# EAGLE design cheapboard1.1qfn (EAGLE 6.2)
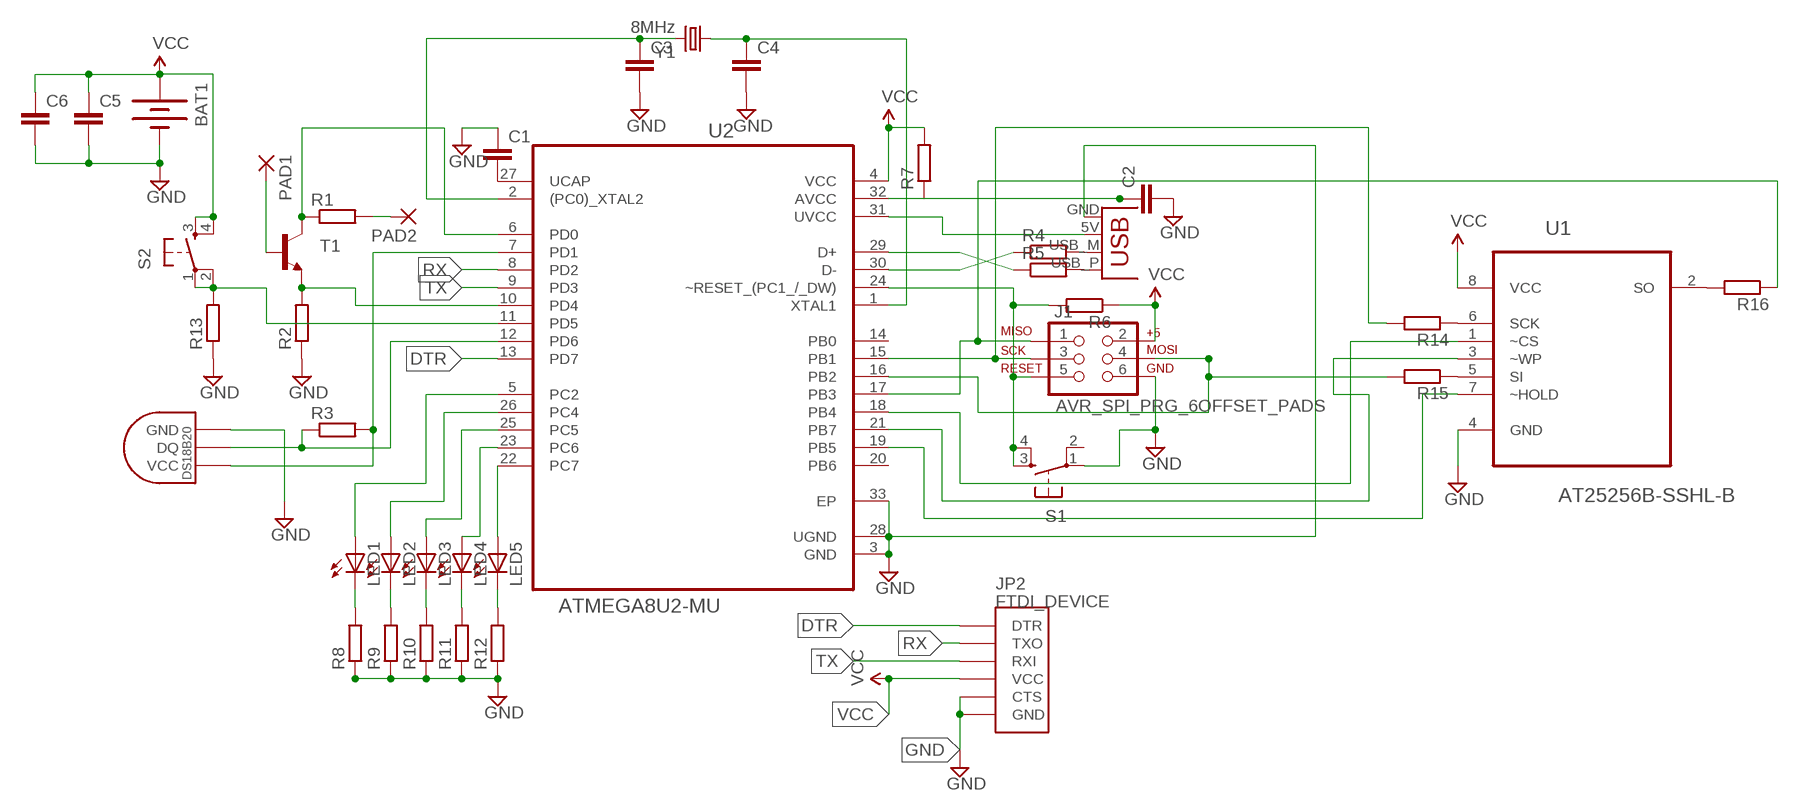
[diagram p0: schematic, sheet 1]

## Parts
BAT1  BATTERY245PTH  [BATTCON_245MM_PTH]
C1  CAP0805  [0805]
C2  CAP0805  [0805]
C3  CAP0805  [0805]
C4  CAP0805  [0805]
C5  CAP0805  [0805]
C6  CAP0805  [0805]
J1  AVR_SPI_PRG_6OFFSET_PADS  [2X3_OFFSET]
JP1  USBPCB  [USB-A-PCB]
JP2  FTDI_DEVICE  [FTDI_DEVICE_SIDE]
LED1  LEDCHIPLED_0805  [CHIPLED_0805]
LED2  LEDCHIPLED_0805  [CHIPLED_0805]
LED3  LEDCHIPLED_0805  [CHIPLED_0805]
LED4  LEDCHIPLED_0805  [CHIPLED_0805]
LED5  LEDCHIPLED_0805  [CHIPLED_0805]
PAD1  SMD5  [SMD2,54-5,08]
PAD2  SMD5  [SMD2,54-5,08]
R1  R-EU_M0805  [M0805]
R2  R-EU_M0805  [M0805]
R3  R-EU_M0805  [M0805]
R4  R-EU_M0805  [M0805]
R5  R-EU_M0805  [M0805]
R6  R-EU_M0805  [M0805]
R7  R-EU_M0805  [M0805]
R8  R-EU_M0805  [M0805]
R9  R-EU_M0805  [M0805]
R10  R-EU_M0805  [M0805]
R11  R-EU_M0805  [M0805]
R12  R-EU_M0805  [M0805]
R13  R-EU_M0805  [M0805]
R14  R-EU_M0805  [M0805]
R15  R-EU_M0805  [M0805]
R16  R-EU_M0805  [M0805]
S1  TAC_SWITCHSMD  [TACTILE_SWITCH_SMD]
S2  TAC_SWITCHSMD  [TACTILE_SWITCH_SMD]
T1  TRANSISTOR_NPNSOT23-3  [SOT23-3]
U1  AT25256B-SSHL-B  [SOIC127P600X175-8N]
U2  ATMEGA8U2-MU  [QFN50P500X500X100-33N]
U$1  DS1820SOIC  [DS18B20_SOIC]
Y1  8MHz  CRYSTAL5X3  [CRYSTAL-SMD-5X3]

## Nets
DTR: JP2.P$1(DTR) U2.13(PD7)
GND: BAT1.2(-) C1.1 C2.2 C3.2 C4.2 C5.2 C6.2 J1.6 JP1.GND JP2.P$5(CTS) JP2.P$6(GND) R2.1 R8.1 R9.1 R10.1 R11.1 R12.1 R13.1 S1.1 U1.4(GND) U2.3(GND) U2.28(UGND) U2.33(EP) U$1.GND
N$1: R1.1 T1.3(C) U2.6(PD0)
N$2: J1.4 R15.2 U2.16(PB2)
N$3: R2.2 T1.2(E) U2.10(PD4)
N$4: J1.5 R6.2 S1.3 S1.4 U2.24(~RESET_(PC1_/_DW))
N$5: J1.3 R14.2 U2.15(PB1)
N$6: R3.1 U2.12(PD6) U$1.DQ
N$7: J1.1 R16.1 U2.17(PB3)
N$8: JP1.5V(VBUS) U2.31(UVCC)
N$9: C2.1 R7.1 U2.32(AVCC)
N$10: R4.1 U2.30(D-)
N$11: R5.1 U2.29(D+)
N$12: JP1.USB_M(D-) R4.2
N$13: JP1.USB_P(D+) R5.2
N$14: R3.2 U2.7(PD1) U$1.VCC
N$15: R14.1 U1.6(SCK)
N$16: C1.2 U2.27(UCAP)
N$17: C4.1 U2.1(XTAL1) Y1.1
N$18: C3.1 U2.2((PC0)_XTAL2) Y1.3
N$19: LED1.A U2.5(PC2)
N$20: LED2.A U2.26(PC4)
N$21: LED3.A U2.25(PC5)
N$22: LED4.A U2.23(PC6)
N$23: LED5.A U2.22(PC7)
N$24: LED1.C R8.2
N$25: LED2.C R9.2
N$26: LED3.C R10.2
N$27: LED4.C R11.2
N$28: LED5.C R12.2
N$29: R15.1 U1.5(SI)
N$30: R13.2 S2.1 S2.2 U2.11(PD5)
N$31: R16.2 U1.2(SO)
N$34: U1.1(~CS) U2.18(PB4)
N$35: U1.3(~WP) U2.21(PB7)
N$36: U1.7(~HOLD) U2.19(PB5)
PAD1: PAD1.1(P) T1.1(B)
PAD2: PAD2.1(P) R1.2
RX: JP2.P$2(TXO) U2.8(PD2)
TX: JP2.P$3(RXI) U2.9(PD3)
VCC: BAT1.3(+) C5.1 C6.1 J1.2 JP2.P$4(VCC) R6.1 R7.2 S2.3 S2.4 U1.8(VCC) U2.4(VCC)
Unconnected: S1.2 U2.14(PB0) U2.20(PB6)

## Library data of the parts
BAT1 = SparkFun-Electromechanical:BATTERY: Battery Holders Various common sizes : AA, AAA, 20mm coin cell and 12mm coin cell. 20MM_4LEGS, BATT-10373
C1-C6 = SparkFun-Passives:CAP: Capacitor Standard 0603 ceramic capacitor, and 0.1" leaded capacitor.
J1 = SparkFun-Connectors:AVR_SPI_PRG_6: AVR ISP 6 Pin This is the reduced ISP connector for AVR programming. Common on Arduino. This footprint will take up less PCB space and can be used with a 10-pin to 6-pin adapter such as SKU: BOB-08508
JP1 = SparkFun-Connectors:USB: USB Connectors USB-B-PTH is fully proven SKU : PRT-00139/CONN-08278 USB-miniB is fully proven SKU : PRT-00587 USB-A-PCB is untested. USB-A-H is throughly reviewed, but untested. Spark Fun Electronics SKU : PRT-00437 USB-B-SMT is throughly reviewed, but untested. Needs silkscreen touching up. USB-A-S has not been used/tested USB-MB-H has not been used/tested USB-MICROB has been used. CONN-09505
JP2 = SparkFun-Connectors:FTDI_DEVICE: Connector which mates to FTDI basic or FTDI cable.
LED1-LED5 = led:LED: LED OSRAM: - CHIPLED LG R971, LG N971, LY N971, LG Q971, LY Q971, LO R971, LY R971 LH N974, LH R974 LS Q976, LO Q976, LY Q976 LO Q996 - Hyper CHIPLED LW Q18S LB Q993, LB Q99A, LB R99A - SideLED LS A670, LO A670, LY A670, LG A670, LP A670 LB A673, LV A673, LT A673, LW A673 LH A674 LY A675 LS A676, LA A676, LO A676, LY A676, LW A676 LS A679, LY A679, LG A679 - Hyper Micro SIDELED® LS Y876, LA Y876, LO Y876, LY Y876 LT Y87S - SmartLED LW L88C, LW L88S LB L89C, LB L89S, LG L890 LS L89K, LO L89K, LY L89K LS L896, LA L896, LO L896, LY L896 - TOPLED LS T670, LO T670, LY T670, LG T670, LP T670 LSG T670, LSP T670, LSY T670, LOP T670, LYG T670 LG T671, LOG T671, LSG T671 LB T673, LV T673, LT T673, LW T673 LH T674 LS T676, LA T676, LO T676, LY T676, LB T676, LH T676, LSB T676, LW T676 LB T67C, LV T67C, LT T67C, LS T67K, LO T67K, LY T67K, LW E67C LS E67B, LA E67B, LO E67B, LY E67B, LB E67C, LV E67C, LT E67C LW T67C LS T679, LY T679, LG T679 LS T770, LO T770, LY T770, LG T770, LP T770 LB T773, LV T773, LT T773, LW T773 LH T774 LS E675, LA E675, LY E675, LS T675 LS T776, LA T776, LO T776, LY T776, LB T776 LHGB T686 LT T68C, LB T68C - Hyper Mini TOPLED® LB M676 - Mini TOPLED Santana® LG M470 LS M47K, LO M47K, LY M47K Source: http://www.osram.convergy.de LUXEON: - LUMILED® LXK2-PW12-R00, LXK2-PW12-S00, LXK2-PW14-U00, LXK2-PW14-V00 LXK2-PM12-R00, LXK2-PM12-S00, LXK2-PM14-U00 LXK2-PE12-Q00, LXK2-PE12-R00, LXK2-PE12-S00, LXK2-PE14-T00, LXK2-PE14-U00 LXK2-PB12-K00, LXK2-PB12-L00, LXK2-PB12-M00, LXK2-PB14-N00, LXK2-PB14-P00, LXK2-PB14-Q00 LXK2-PR12-L00, LXK2-PR12-M00, LXK2-PR14-Q00, LXK2-PR14-R00 LXK2-PD12-Q00, LXK2-PD12-R00, LXK2-PD12-S00 LXK2-PH12-R00, LXK2-PH12-S00 LXK2-PL12-P00, LXK2-PL12-Q00, LXK2-PL12-R00 Source: www.luxeon.com KINGBRIGHT: KA-3528ASYC Source: www.kingbright.com
PAD1 PAD2 = wirepad:SMD5: SMD PAD
R1-R16 = rcl:R-EU_: RESISTOR, European symbol
S1 S2 = SparkFun-Electromechanical:TAC_SWITCH: Momentary Switch Button commonly used for reset or general input. Spark Fun Electronics SKU : COM-00097 SMT- SWCH-08247; PROD_ID: SWCH-08247
T1 = SparkFun-DiscreteSemi:TRANSISTOR_NPN: Generic NPN BJT. MMBT2222 is the common NPN we use. Double check against datasheet- not all devices are the same!
U1 = Mine:AT25256B-SSHL-B: SPI Serial EEPROM; MPN: AT25256B-SSHL-B; OC_FARNELL: 1841577; OC_NEWARK: 12T1358; PACKAGE: SOIC-8; SUPPLIER: Atmel
U2 = Atmel_By_element14_Batch_1:ATMEGA8U2-MU: Microcontroller with 8/16/32K Bytes of ISP Flash and USB Controller; MPN: ATMEGA8U2-MU; OC_FARNELL: 1748536; OC_NEWARK: 26R5642; PACKAGE: QFN-32; SUPPLIER: Atmel
U$1 = Ava:DS1820: DS18B20 Programmable Resolution 1-Wire Digital Thermometer Description The DS18B20 digital thermometer provides 9-bit to 12-bit Celsius temperature measurements and has an alarm function with nonvolatile user-programmable upper and lower trigger points. The DS18B20 communicates over a 1-Wire® bus that by definition requires only one data line (and ground) for communication with a central microprocessor. It has an operating temperature range of -55°C to +125°C and is accurate to ±0.5°C over the range of -10°C to +85°C. In addition, the DS18B20 can derive power directly from the data line ("parasite power"), eliminating the need for an external power supply. Each DS18B20 has a unique 64-bit serial code, which allows multiple DS18B20s to function on the same 1-Wire bus. Thus, it is simple to use one microprocessor to control many DS18B20s distributed over a large area. Applications that can benefit from this feature include HVAC environmental controls, temperature monitoring systems inside buildings, equipment, or machinery, and process monitoring and control systems.
Y1 = SparkFun-FreqCtrl:CRYSTAL: Various standard crystals. Proven footprints. Spark Fun Electronics SKU : COM-00534

## Board
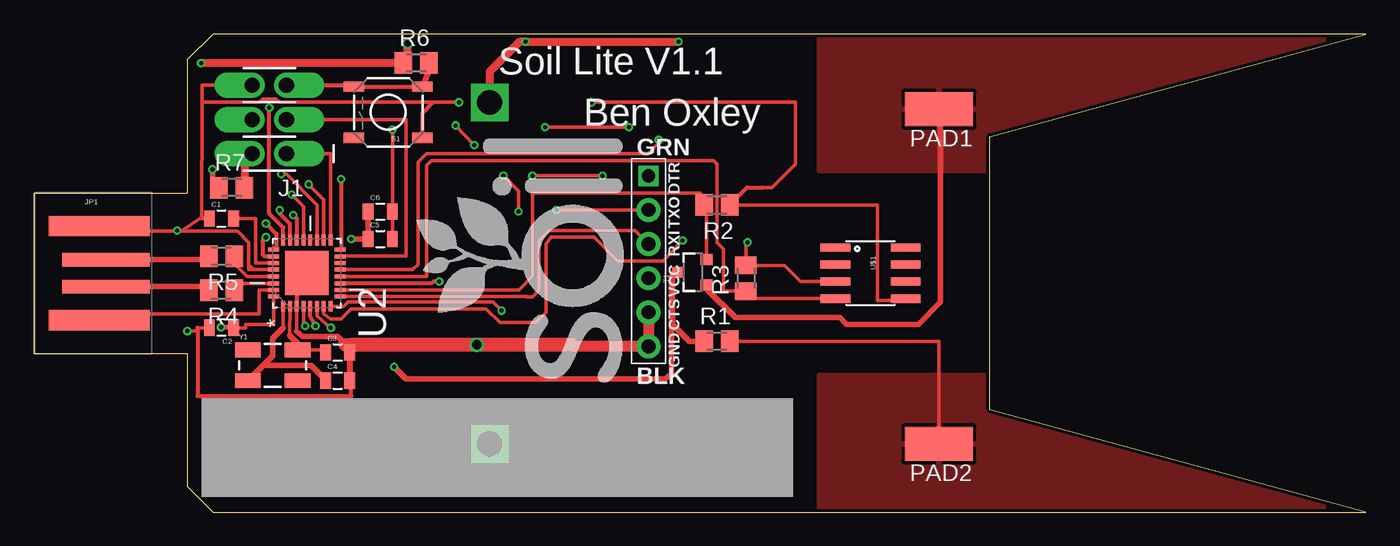
[diagram p1: board, top side]
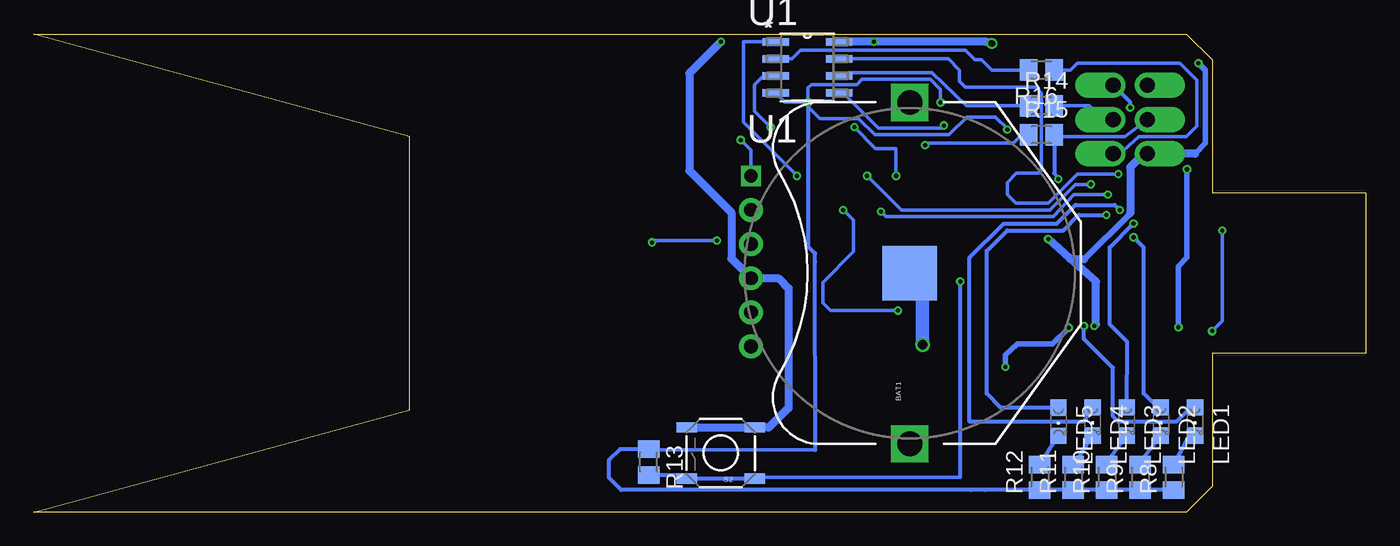
[diagram p2: board, bottom side, seen from below]

Size 99.06 x 35.56 mm. Coordinates in mm from the lower left corner, seen from the top.
Outline: 11.43,1.91 13.34,0 99.06,0 71.12,7.62 71.12,27.94 99.06,35.56 13.34,35.56 11.43,33.66 11.43,23.75 0,23.75 0,11.81 11.43,11.81 11.43,1.91
Copper layers (1*16): Top 0.035mm / dielectric 1.5mm / Bottom 0.035mm
Design rules: minimum track width 6mil, minimum drill 12mil, track to track 6mil, track to pad 6mil, pad to pad 6mil, via to via 6mil, smd to smd 0mil, copper to edge 10mil, drill to drill 10mil, minimum pad ring 10mil, minimum via ring 6mil, stop-mask expansion 2mil, vias tented up to drill 100mil, thermal gap 10mil

### Footprints (pad centres in the part's own frame; a part is rotated, then mirrored left to right if it is on the bottom)
BATTCON_245MM_PTH = drill 1.854 square: 1 -12.7,0; 3 12.7,0 | smd 4.064 x 4.064: 2 0,0
0805 = smd 0.8 x 1.2: 1 -0.9,0; 2 0.9,0
2X3_OFFSET = drill 1.118 pad 1.88 offset: 1 -2.54,-1.27; 2 -2.54,1.27; 3 0,-1.27; 4 0,1.27; 5 2.54,-1.27; 6 2.54,1.27
USB-A-PCB = smd 7.5 x 1.5: 5V -0.2,-3.5; GND -0.2,3.5 | smd 6.5 x 1: USB_M 0.3,-1; USB_P 0.3,1
FTDI_DEVICE_SIDE = drill 1 square: P$1 -6.35,0 | drill 1.016 pad 1.778: P$2 -3.81,0; P$3 -1.27,0; P$4 1.27,0; P$5 3.81,0; P$6 6.35,0
CHIPLED_0805 = smd 1.2 x 1.2: A 0,-1.05; C 0,1.05
SMD2,54-5,08 = smd 2.54 x 5.08: 1 0,0
M0805 = smd 1.3 x 1.6: 1 -0.95,0; 2 0.95,0
TACTILE_SWITCH_SMD = smd 1.524 x 0.762: 1 -2.54,1.905; 2 2.54,1.905; 3 -2.54,-1.905; 4 2.54,-1.905
SOT23-3 = smd 0.8 x 0.9: 1 -0.95,-1; 2 0.95,-1; 3 0,1.1
SOIC127P600X175-8N = smd 1.981 x 0.559: 1 -2.362,1.905; 2 -2.362,0.635; 3 -2.362,-0.635; 4 -2.362,-1.905; 5 2.362,-1.905; 6 2.362,-0.635; 7 2.362,0.635; 8 2.362,1.905
QFN50P500X500X100-33N = smd 0.813 x 0.305: 1 -2.464,1.753; 2 -2.464,1.245; 3 -2.464,0.762; 4 -2.464,0.254; 5 -2.464,-0.254; 6 -2.464,-0.762; 7 -2.464,-1.245; 8 -2.464,-1.753; 17 2.464,-1.753; 18 2.464,-1.245; 19 2.464,-0.762; 20 2.464,-0.254; 21 2.464,0.254; 22 2.464,0.762; 23 2.464,1.245; 24 2.464,1.753 | smd 0.305 x 0.813: 9 -1.753,-2.464; 10 -1.245,-2.464; 11 -0.762,-2.464; 12 -0.254,-2.464; 13 0.254,-2.464; 14 0.762,-2.464; 15 1.245,-2.464; 16 1.753,-2.464; 25 1.753,2.464; 26 1.245,2.464; 27 0.762,2.464; 28 0.254,2.464; 29 -0.254,2.464; 30 -0.762,2.464; 31 -1.245,2.464; 32 -1.753,2.464 | smd 3.251 x 3.251: 33 0,0
DS18B20_SOIC = smd 0.61 x 2.21: DQ 1.905,-2.616; GND 1.905,2.616; NC -1.905,-2.616; NC2 -0.635,-2.616; NC3 -1.905,2.616; NC4 -0.635,2.616; NC5 0.635,2.616; VCC 0.635,-2.616
CRYSTAL-SMD-5X3 = smd 1.9 x 1.1: 1 -1.85,-1.15; 2 1.85,-1.15; 3 1.85,1.15; 4 -1.85,1.15

### Placement (x,y rotation side)
BAT1  33.91,17.78 90 bottom
C1  13.97,21.84 0 top
C2  13.97,13.72 180 top
C3  22.61,11.87 0 top
C4  22.61,9.78 0 top
C5  25.78,20.32 0 top
C6  25.78,22.35 0 top
J1  17.53,29.21 90 top
JP1  5.08,17.78 0 top
JP2  45.72,18.67 270 top
LED1  12.7,6.74 180 bottom
LED2  15.24,6.74 180 bottom
LED3  17.78,6.74 180 bottom
LED4  20.32,6.74 180 bottom
LED5  22.86,6.72 180 bottom
PAD1  67.31,29.97 90 top
PAD2  67.31,5.08 90 top
R1  50.8,12.7 0 top
R2  50.8,22.86 180 top
R3  52.96,17.4 90 top
R4  13.97,16.51 180 top
R5  13.97,19.05 180 top
R6  28.45,33.4 0 top
R7  14.73,24.13 0 top
R8  14.29,2.6 90 bottom
R9  16.78,2.6 90 bottom
R10  19.27,2.6 90 bottom
R11  21.76,2.6 90 bottom
R12  24.24,2.6 90 bottom
R13  53.33,3.72 270 bottom
R14  24.13,30.23 0 bottom
R15  24.13,28.07 0 bottom
R16  24.13,32.89 180 bottom
S1  26.37,29.74 180 top
S2  47.97,4.39 180 bottom
T1  49.02,17.84 90 top
U1  41.53,33.08 0 bottom
U2  20.32,17.78 90 top
U$1  62.23,17.78 270 top
Y1  17.78,10.92 0 top

### Tracks (layer width: path | path; a pad name or v marks a point on that pad's centre or on a via)
DTR  (via drill 0.3)
  Top 0.254: U2.13 28.19,18.03 28.57,18.41 28.57,26.04 29.21,26.67 45.72,26.67 46.48,27.43 v46.48,27.69
  Bottom 0.254: v46.48,27.69 45.72,26.92 JP2.P$1
GND  (via drill 0.3, 0.3 pad 0.25, 0.7)
  Top 0.254: J1.6 12.52,31.75 12.52,30.48 | 12.51,21.86 C1.1 | U2.3 19.56,13.45 | 22.61,13.06 22.64,13.03 | 23.19,12.45 C3.2 | R2.1 62.74,22.86 62.74,15.75 64.85,15.75 U$1.GND | C2.2 12.32,13.72 | 12.32,13.72 12.19,13.72 | 23.62,8.64 23.63,8.64 C4.2 | 12.51,21.86 12.52,30.48 | 12.52,30.48 16.76,30.48 17.02,30.73 18.03,30.73 18.29,30.48 29.72,30.48 v31.62,30.48 | v41.47,30.48 56.64,30.48 56.64,25.89 54.9,24.16 54.22,24.16 | 16,18.29 16,18.03 U2.28 16.38,18.03 16.13,18.29 16,18.29 | 10.99,20.89 8.5,20.89 8.18,21.34 JP1.GND | C5.2 C6.2 26.68,28.44 v26.67,28.45 | 16,18.29 16,20.07 15.18,20.89 10.99,20.89 | 10.99,20.89 11.05,20.95 | 11.05,20.95 v10.67,20.95 | v11.43,13.46 12.06,13.46 12.32,13.72 | 12.51,21.86 12.33,21.86 11.05,20.95
  Top 0.305: R2.1 53.05,24.16 54.22,24.16 | 29.72,30.48 28.91,29.67 S1.1 | C1.1 12.57,21.84 | 12.19,13.72 12.19,8.64 23.62,8.64 23.62,12.57 | 20.32,16.83 19.56,16.07 U2.3
  Top 0.406: 19.56,13.45 20.02,13.06 22.61,13.06 | 22.64,13.03 22.86,12.83 22.86,12.45 23.19,12.45 | C4.2 C3.2 | U2.33 20.32,16.83
  Top 0.813: 23.62,12.57 40.01,12.57 v32.96,12.45 | JP2.P$5 JP2.P$6 40.13,12.32 39.5,12.45
  Top 1.016: 23.19,12.45 v32.96,12.45 39.5,12.45
  Bottom 0.254: v26.67,28.45 26.67,28.51 27.56,29.4 29.65,29.4 30.99,28.07 36.51,28.07 37.72,29.27 40.58,29.27 41.47,30.16 v41.47,30.48 | v10.67,20.95 10.67,14.22 v11.43,13.46 | v41.47,30.48 43.18,30.48 U1.4 | v31.62,30.48 31.62,31.43 32.38,32.19 37.47,32.19 37.85,31.81 41.21,31.81 41.47,31.56 v41.47,30.48
  Bottom 0.305: R8.1 R9.1 R10.1 R11.1 | R11.1 R12.1 | R11.1 28.32,1.65 29.34,1.65 55.37,1.65 56.26,2.54 56.26,3.87 55.44,4.7 53.29,4.7 R13.1 40.95,4.62 40.96,18.61 40.96,19.24 41.47,19.75 v41.47,30.48
  Bottom 1.016: v32.96,12.45 32.96,16.95 BAT1.2
N$1  (via drill 0.3)
  Top 0.254: U2.6 21.08,14.61 v22.1,13.72
  Top 0.406: R1.1 48.77,12.7 47.5,13.97 47.5,17.7 T1.3 47.75,17.84 47.43,17.53 47.41,10.33 46.99,9.91 27.69,9.91 v26.8,10.79
  Bottom 0.406: v26.8,10.79 26.8,11.68 25.91,12.51 23.3,12.51 v22.1,13.72
N$2  (via drill 0.3)
  Top 0.305: v22.86,24.77 22.86,19.61 U2.16
  Bottom 0.254: R15.2 23.24,28.07 23.05,27.94 17.91,27.94 J1.4
  Bottom 0.305: R15.2 23.18,25.21 v22.86,24.77
N$3
  Top 0.254: U2.10 36.07,16.51 36.09,16.54 37.08,17.55 37.08,23.75 49.28,23.75 | 49.28,23.75 49.53,23.75 49.85,23.37 50.02,23.19 T1.2 | R2.2 49.85,23.18 49.28,23.75
N$4  (via drill 0.3)
  Top 0.305: J1.5 23.72,31.75 S1.4 S1.3 | U2.24 18.57,21.18 17.53,22.23 v17.53,30.1
  Top 0.406: R6.2 29.46,33.15 29.34,32.7 28.93,31.62 S1.3
  Bottom 0.305: v17.53,30.1 17.53,30.48 J1.5
N$5
  Top 0.254: J1.3 27.69,29.21 27.69,19.05 22.78,19.05 U2.15
  Bottom 0.254: R14.2 20.57,30.23 19.68,29.34 18.92,29.34 J1.3
N$6
  Top 0.254: U$1.DQ 53.09,15.88 R3.1 51.31,16.45 51.31,19.56 50.8,20.07 50.8,25.91 50.55,26.16 29.59,26.16 29.21,25.78 29.21,17.53 U2.12
N$7
  Top 0.254: J1.1 22.07,26.67 U2.17
  Bottom 0.254: R16.1 21.97,32.89 21.46,33.4 13.84,33.4 12.57,32.13 12.57,28.7 13.34,27.94 16.89,27.94 18.41,26.54 18.67,26.54 J1.1
N$8
  Top 0.254: U2.31 16.76,16.54 16.76,14.73 4.88,14.73 JP1.5V
N$9  (via drill 0.3)
  Top 0.254: C2.1 15.75,13.72 15.75,13.97 17.86,13.97 U2.32 | R7.1 13.72,24.13 13.72,24.38
  Top 0.406: R7.1 13.3,24.13 v13.3,25.5 | v13.93,13.75 14.93,13.77 C2.1
  Bottom 0.406: v13.3,25.5 13.3,18.92 13.93,18.29 v13.93,13.75
N$10
  Top 0.254: U2.30 15.43,17.02 R4.1
N$11
  Top 0.254: U2.29 15.88,17.53 14.86,18.54 14.86,18.99 R5.1
N$12
  Top 0.406: JP1.USB_M 13.02,16.78 R4.2
N$13
  Top 0.406: JP1.USB_P 13.02,18.78 R5.2
N$14  (via drill 0.3)
  Top 0.254: U2.7 21.57,14.76 22.1,14.35 22.86,14.35 23.62,15.11 33.66,15.11 34.67,14.1 37.34,14.1 38.1,14.86 38.1,19.94 38.48,20.45 41.66,20.45 43.43,18.67 46.8,18.67 v48.26,20.19 | v53.09,20.07 52.96,20 R3.2 55.82,18.35 57.02,17.14 U$1.VCC
  Bottom 0.254: v48.26,20.19 52.83,20.19 v53.09,20.07
N$15
  Bottom 0.254: R14.1 29.72,30.23 32.26,32.7 38.48,32.7 | 38.35,32.51 38.48,32.7 | 38.48,32.7 U1.6
N$16
  Top 0.254: U2.27 16.51,18.54 16.51,21.84 C1.2
N$17
  Top 0.254: 18.57,13.71 U2.1
  Top 0.406: 18.57,13.71 17.78,12.92 17.78,11.62 Y1.1 17.08,10.92 20.64,10.92 21.72,9.84 C4.1
N$18
  Top 0.254: 20.09,12.1 20.47,12.07 Y1.3 20.9,12.06 21.72,12.06 21.84,11.87 C3.1 | 19.05,13.14 U2.2
  Top 0.406: 20.09,12.1 19.05,13.14
N$19  (via drill 0.3)
  Top 0.305: v20.95,13.84 20.83,14.1 20.57,14.55 U2.5
  Bottom 0.305: LED1.A 13.21,7.87 12.95,7.87 14.1,6.73 18.41,6.73 18.8,7.11 18.8,10.73 20.95,12.89 v20.95,13.84
N$20  (via drill 0.3)
  Top 0.305: v17.27,20.45 17.02,20.19 17.02,19.18 17.14,19.05 17.83,19.05 U2.26
  Bottom 0.305: LED2.A 15.48,7.79 16.51,8.83 16.51,19.68 v17.27,20.45
N$21  (via drill 0.3)
  Top 0.305: v17.27,21.46 18.03,20.7 18.03,19.71 U2.25
  Bottom 0.305: LED3.A 17.74,12.68 19.05,13.97 19.05,19.68 v17.27,21.46
N$22  (via drill 0.3)
  Top 0.305: v18.29,22.48 18.29,22.23 19.05,21.46 19.05,20.27 U2.23
  Bottom 0.305: LED4.A 20.95,6.73 29.46,6.73 29.46,18.92 26.92,21.46 22.99,21.46 21.59,22.86 18.67,22.86 v18.29,22.48
N$23  (via drill 0.3)
  Top 0.305: v19.3,22.1 19.56,21.84 U2.22
  Bottom 0.305: LED5.A 27.14,7.77 28.19,8.83 28.19,19.43 26.67,20.95 22.5,20.95 21.34,22.12 21.21,22.1 v19.3,22.1
N$24
  Bottom 0.305: R8.2 13.14,5.68 LED1.C
N$25
  Bottom 0.305: LED2.C 16.87,3.64 R9.2
N$26
  Bottom 0.305: LED3.C 19.33,3.68 R10.2
N$27
  Bottom 0.305: R11.2 21.69,3.56 LED4.C
N$28
  Bottom 0.305: R12.2 22.91,5.68 LED5.C
N$29  (via drill 0.3)
  Top 0.254: v32.77,27.3 v31.37,28.77
  Bottom 0.254: R15.1 25.59,28.07 26.23,27.43 32.7,27.43 v32.77,27.3 | v31.37,28.77 v31.37,28.78 31.38,28.78 31.56,28.57 36.26,28.57 38.86,31.18 U1.5
N$30  (via drill 0.3 pad 0.25)
  Top 0.305: v30.16,17.14 29.72,17.14 29.59,17.02 U2.11
  Bottom 0.305: R13.2 50.85,2.77 S2.2 S2.1 45.54,2.62 30.16,2.6 v30.16,17.14 30.06,17.12
N$31
  Bottom 0.254: R16.2 27.81,32.89 28.57,33.66 29.08,33.66 29.78,34.35 42.04,34.35 42.67,33.72 U1.2
N$34  (via drill 0.3)
  Top 0.254: U2.18 21.57,23.27 v20.45,24.38 | v37.08,25.02 v42.29,25.02
  Bottom 0.254: v20.45,24.38 21.59,24.38 23.5,22.48 34.54,22.48 v37.08,25.02 | v42.29,25.02 46.29,29.02 46.29,34.99 U1.1
N$35  (via drill 0.3)
  Top 0.254: U2.21 20.07,22.73 v19.18,23.62 | v36.07,22.35 36.07,23.88 v34.92,25.02 | v44.26,28.64 v38.04,28.64
  Bottom 0.254: v19.18,23.62 21.72,23.62 23.24,21.97 35.69,21.97 v36.07,22.35 | v34.92,25.02 34.92,27.05 36.45,27.05 v38.04,28.64 | U1.3 44.83,32.45 45.47,31.81 45.47,29.84 v44.26,28.64
N$36  (via drill 0.3)
  Top 0.254: U2.19 21.08,22.86 18.8,25.15 v18.41,25.15
  Bottom 0.254: v18.41,25.15 21.46,25.15 23.62,22.99 26.04,22.99 26.67,23.62 26.67,24.51 25.97,25.21 24.32,25.21 24.13,25.4 24.13,31.18 24.51,31.62 29.78,31.62 30.23,32.07 30.23,32.89 31.05,33.72 U1.7
PAD1
  Top 0.406: T1.1 50.1,17.02 50.1,16.51 52.2,14.48 59.94,14.48 60.45,13.97 65.79,13.97 67.44,15.62 67.44,28.32 67.31,30.99 PAD1.1
  pour Top: 108.2,36.7 58.42,39.24 58.42,25.4 90.68,25.4
PAD2
  Top 0.254: R1.2 67.31,12.7 PAD2.1
  pour Top (isolate 0.254): 89.28,10.16 58.42,10.16 58.42,-0.51 108.97,-0.51
RX  (via drill 0.3)
  Top 0.254: U2.8 23.06,15.32 23.37,15.62 34.16,15.62 v34.8,14.99 | v38.86,22.48 JP2.P$2
  Bottom 0.254: v34.8,14.99 39.81,14.99 40.39,15.56 40.39,17.08 38.1,19.37 38.1,21.72 v38.86,22.48
TX
  Top 0.254: U2.9 36.68,16.03 36.7,16 37.08,16 37.59,16.51 37.59,20.19 38.35,20.95 44.7,20.95 JP2.P$3
VCC  (via drill 0.3, 0.5)
  Top 0.254: U2.4 20.07,13.97 v20.19,13.84
  Top 0.305: R6.1 27.81,33.15
  Top 0.406: C6.1 C5.1 v23.62,20.32
  Top 0.61: J1.2 15.68,26.67 R7.2 | R6.1 v12.45,33.4 | 27.81,33.15 v27.81,34.86 | v47.94,34.99 v36.58,34.99 36.13,34.99 33.91,32.77 BAT1.3
  Bottom 0.254: U1.8 v36.58,34.99 | 45.41,6.29 S2.3
  Bottom 0.406: v12.45,33.4 11.94,32.89 11.94,27.43 12.7,26.67 | 17.53,22.23 20.95,18.8
  Bottom 0.61: v47.94,34.99 50.29,32.64 50.29,25.4 47.18,22.29 47.18,18.86 JP2.P$4 43.69,17.4 42.93,16.64 42.93,7.75 44.39,6.29 45.41,6.29 | 12.7,26.67 J1.2 16.51,26.67 17.53,25.65 17.53,22.23 | v20.19,13.84 20.07,13.97 20.07,17.14 22.01,18.88 | 22.01,18.88 v23.62,20.32 | v27.81,34.86 28.23,34.99 U1.8 | 20.95,18.8 21.93,18.8 22.01,18.88 | S2.4 S2.3

### Text on the board
_tsilk: Soil Lite V1.1 | Ben Oxley